# EAGLE design Steuerung (EAGLE 7.3.0)
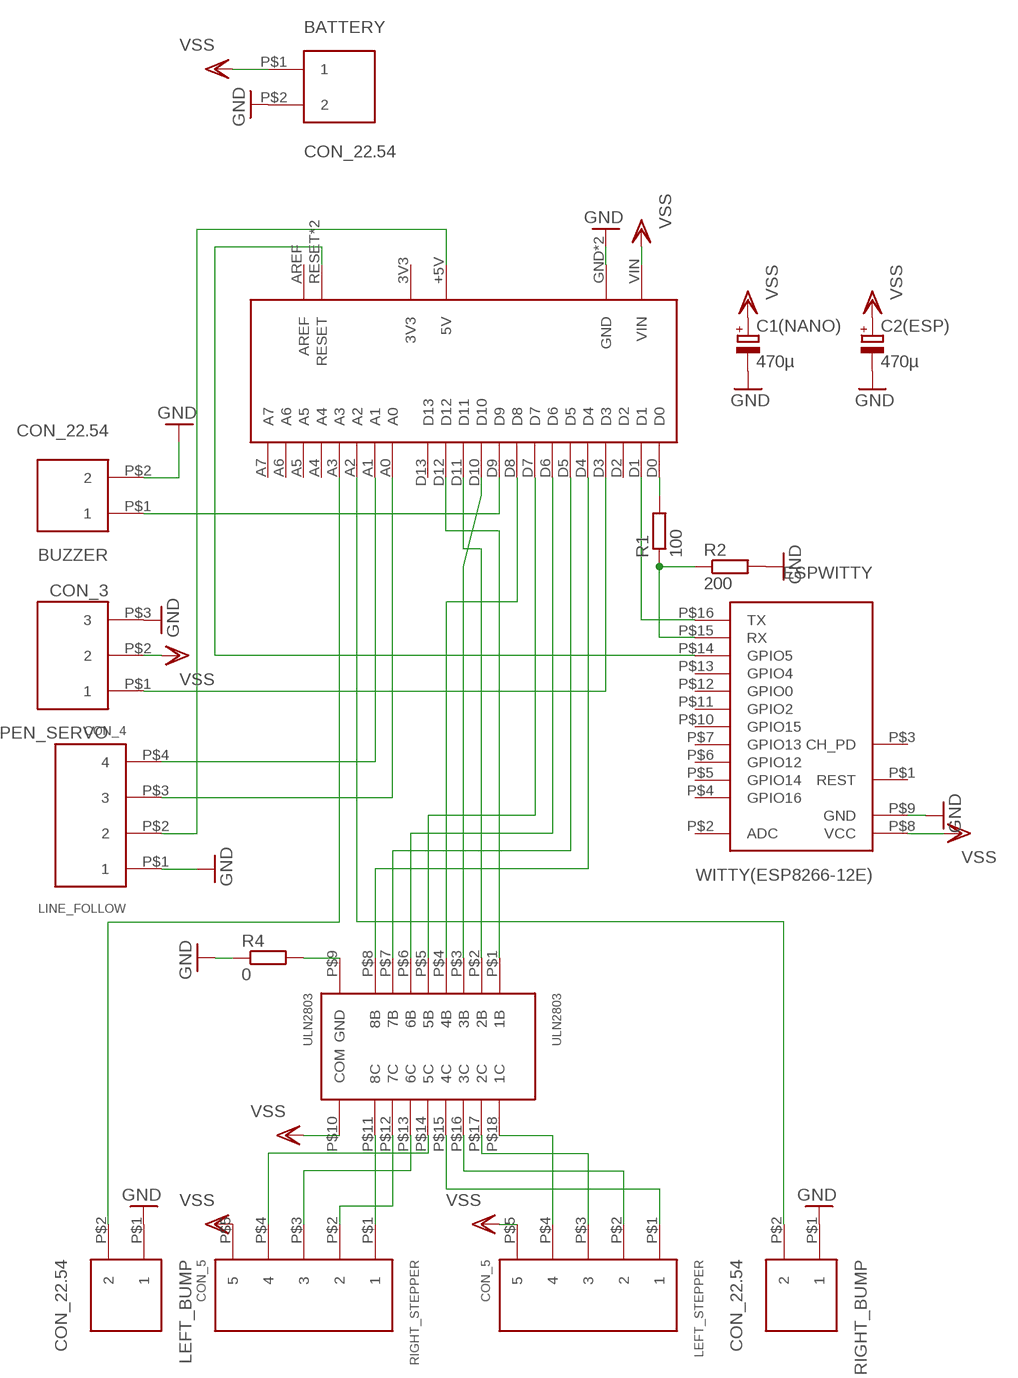
[diagram p0: schematic, sheet 1]

## Parts
ARDUINO_NANO  ARDUINO_NANO  [ARDUINO_NANO]
BATTERY  CON_22.54  [CON_2_2.54]
BUZZER  CON_22.54  [CON_2_2.54]
C1(NANO)  470µ  CPOL-EUE2.5-7  [E2,5-7]
C2(ESP)  470µ  CPOL-EUE2.5-7  [E2,5-7]
LEFT_BUMP  CON_22.54  [CON_2_2.54]
LEFT_STEPPER  CON_5  [CON_5_2.54]
LINE_FOLLOW  CON_4  [CON_4_2.54]
PEN_SERVO  CON_3  [CON_3_2.54]
R1  100  R-EU_0204/7  [0204/7]
R2  200  R-EU_0204/7  [0204/7]
R4  0  R-EU_R1206  [R1206]
RIGHT_BUMP  CON_22.54  [CON_2_2.54]
RIGHT_STEPPER  CON_5  [CON_5_2.54]
ULN2803  ULN2803  [DIP_18]
WITTY(ESP8266-12E)  ESPWITTY  [ESP-WITTY]

## Nets
GND: ARDUINO_NANO.GND ARDUINO_NANO.GND2(GND) BATTERY.P$2 BUZZER.P$2 C1(NANO).- C2(ESP).- LEFT_BUMP.P$1 LINE_FOLLOW.P$1 PEN_SERVO.P$3 R2.2 R4.1 RIGHT_BUMP.P$1 WITTY(ESP8266-12E).P$9(GND)
N$1: LEFT_STEPPER.P$4 ULN2803.P$18(1C)
N$2: LEFT_STEPPER.P$3 ULN2803.P$17(2C)
N$3: LEFT_STEPPER.P$2 ULN2803.P$16(3C)
N$4: LEFT_STEPPER.P$1 ULN2803.P$15(4C)
N$5: RIGHT_STEPPER.P$4 ULN2803.P$14(5C)
N$6: RIGHT_STEPPER.P$3 ULN2803.P$13(6C)
N$7: RIGHT_STEPPER.P$2 ULN2803.P$12(7C)
N$8: RIGHT_STEPPER.P$1 ULN2803.P$11(8C)
N$9: ARDUINO_NANO.D8 ULN2803.P$4(4B)
N$10: ARDUINO_NANO.D10 ULN2803.P$3(3B)
N$11: ARDUINO_NANO.D11 ULN2803.P$2(2B)
N$12: ARDUINO_NANO.D12 ULN2803.P$1(1B)
N$13: ARDUINO_NANO.D7 ULN2803.P$5(5B)
N$14: ARDUINO_NANO.D6 ULN2803.P$6(6B)
N$15: ARDUINO_NANO.D5 ULN2803.P$7(7B)
N$16: ARDUINO_NANO.D4 ULN2803.P$8(8B)
N$18: ARDUINO_NANO.A2 RIGHT_BUMP.P$2
N$19: ARDUINO_NANO.D0 R1.2
N$20: R1.1 R2.1 WITTY(ESP8266-12E).P$15(RX)
N$21: ARDUINO_NANO.D1 WITTY(ESP8266-12E).P$16(TX)
N$22: ARDUINO_NANO.RESET ARDUINO_NANO.RST(RESET) WITTY(ESP8266-12E).P$14(GPIO5)
N$23: ARDUINO_NANO.D9 BUZZER.P$1
N$24: ARDUINO_NANO.D3 PEN_SERVO.P$1
N$25: ARDUINO_NANO.A1 LINE_FOLLOW.P$4
N$26: ARDUINO_NANO.A0 LINE_FOLLOW.P$3
N$28: ARDUINO_NANO.A3 LEFT_BUMP.P$2
N$29: R4.2 ULN2803.P$9(GND)
N$30: ARDUINO_NANO.+5V(5V) LINE_FOLLOW.P$2
VSS: ARDUINO_NANO.VIN BATTERY.P$1 C1(NANO).+ C2(ESP).+ LEFT_STEPPER.P$5 PEN_SERVO.P$2 RIGHT_STEPPER.P$5 ULN2803.P$10(COM) WITTY(ESP8266-12E).P$8(VCC)
Unconnected: ARDUINO_NANO.3V3 ARDUINO_NANO.A4 ARDUINO_NANO.A5 ARDUINO_NANO.A6 ARDUINO_NANO.A7 ARDUINO_NANO.AREF ARDUINO_NANO.D2 ARDUINO_NANO.D13 WITTY(ESP8266-12E).P$1(REST) WITTY(ESP8266-12E).P$2(ADC) WITTY(ESP8266-12E).P$3(CH_PD) WITTY(ESP8266-12E).P$4(GPIO16) WITTY(ESP8266-12E).P$5(GPIO14) WITTY(ESP8266-12E).P$6(GPIO12) WITTY(ESP8266-12E).P$7(GPIO13) WITTY(ESP8266-12E).P$10(GPIO15) WITTY(ESP8266-12E).P$11(GPIO2) WITTY(ESP8266-12E).P$12(GPIO0) WITTY(ESP8266-12E).P$13(GPIO4)

## Library data of the parts
ARDUINO_NANO = pcaroli:ARDUINO_NANO
BATTERY BUZZER LEFT_BUMP RIGHT_BUMP = pcaroli:CON_2
C1(NANO) C2(ESP) = resistor:CPOL-EU: POLARIZED CAPACITOR, European symbol
LEFT_STEPPER RIGHT_STEPPER = pcaroli:CON_5
LINE_FOLLOW = pcaroli:CON_4
PEN_SERVO = pcaroli:CON_3
R1 R2 = resistor:R-EU_: RESISTOR, European symbol
R4 = rcl-2:R-EU_: RESISTOR, European symbol
ULN2803 = pcaroli:ULN2803
WITTY(ESP8266-12E) = pcaroli:ESP

## Board
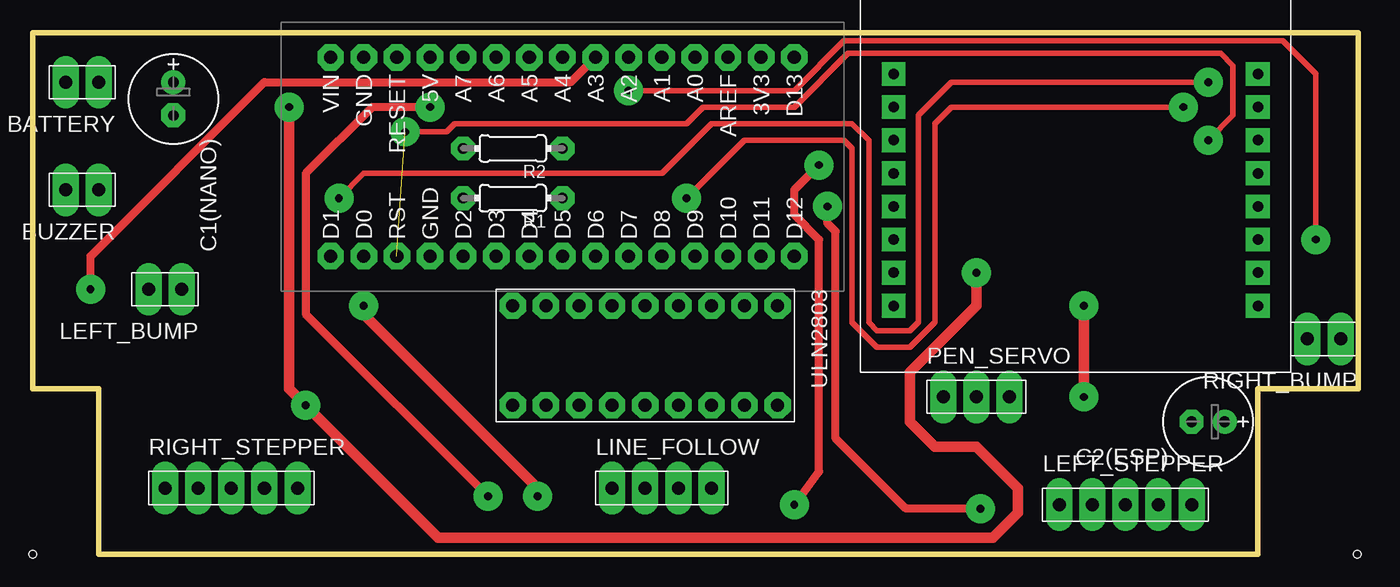
[diagram p1: board, top side]
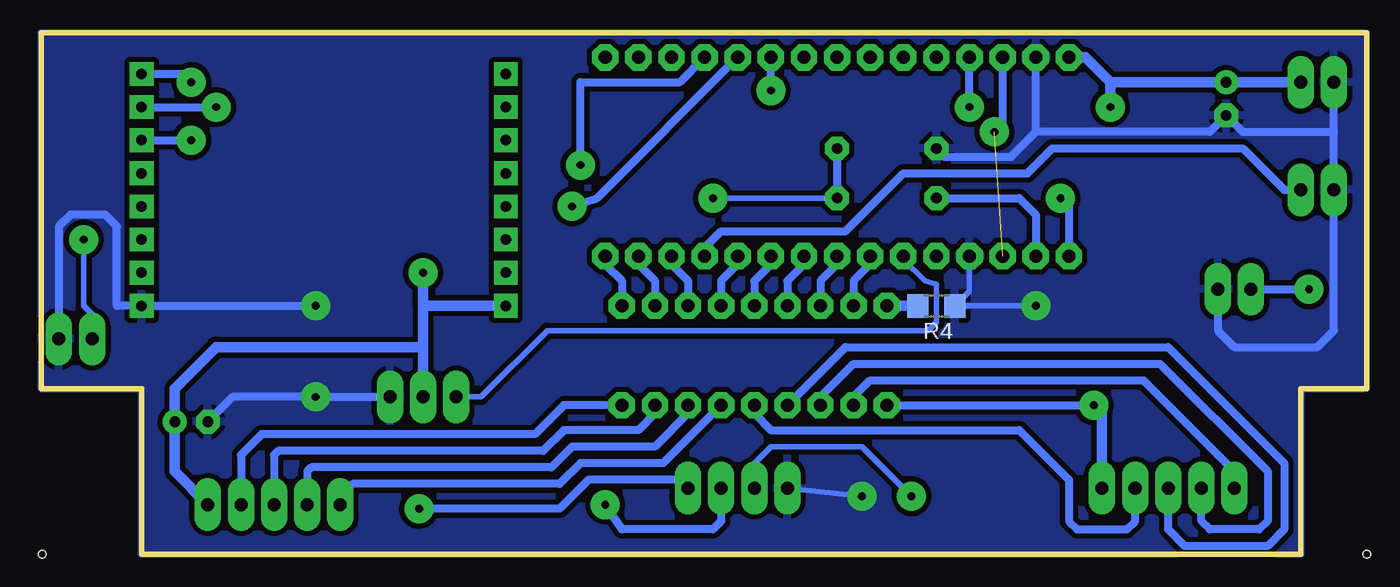
[diagram p2: board, bottom side, seen from below]

Size 101.68 x 40 mm. Coordinates in mm from the lower left corner, seen from the top.
Outline: 101.68,40 0,40 0,12.7 5.08,12.7 5.08,0 93.98,0 93.98,12.7 101.68,12.7 101.68,40
Copper layers (1*16): Top 0.035mm / dielectric 1.5mm / Bottom 0.035mm
Design rules "proxxon *": minimum track width 16mil, minimum drill 16mil, track to track 16mil, track to pad 16mil, pad to pad 16mil, via to via 16mil, smd to smd 8mil, copper to edge 0mil, drill to drill 40mil, minimum pad ring 20mil, minimum via ring 32mil, stop-mask expansion 4mil, vias tented up to drill 0mil, thermal gap 16mil
Holes 0.6 mm at 0,0 101.6,0

### Footprints (pad centres in the part's own frame; a part is rotated, then mirrored left to right if it is on the bottom)
ARDUINO_NANO = drill 1 octagon: 3V3 7.62,-15.24; +5V 7.62,10.16; A0 7.62,-10.16; A1 7.62,-7.62; A2 7.62,-5.08; A3 7.62,-2.54; A4 7.62,0; A5 7.62,2.54; A6 7.62,5.08; A7 7.62,7.62; AREF 7.62,-12.7; D0 -7.62,15.24; D1 -7.62,17.78; D2 -7.62,7.62; D3 -7.62,5.08; D4 -7.62,2.54; D5 -7.62,0; D6 -7.62,-2.54; D7 -7.62,-5.08; D8 -7.62,-7.62; D9 -7.62,-10.16; D10 -7.62,-12.7; D11 -7.62,-15.24; D12 -7.62,-17.78; D13 7.62,-17.78; GND -7.62,10.16; GND2 7.62,15.24; RESET 7.62,12.7; RST -7.62,12.7; VIN 7.62,17.78
CON_2_2.54 = drill 1 pad 1.93 long: P$1 -1.27,0; P$2 1.27,0
E2,5-7 = drill 0.813 pad 1.6: + -1.27,0 | drill 0.813 pad 1.6 octagon: - 1.27,0
CON_5_2.54 = drill 1 pad 1.93 long: P$1 -5.08,0; P$2 -2.54,0; P$3 0,0; P$4 2.54,0; P$5 5.08,0
CON_4_2.54 = drill 1 pad 1.93 long: P$1 -3.81,0; P$2 -1.27,0; P$3 1.27,0; P$4 3.81,0
CON_3_2.54 = drill 1 pad 1.93 long: P$1 -2.54,0; P$2 0,0; P$3 2.54,0
0204/7 = drill 0.813 octagon: 1 -3.81,0; 2 3.81,0
R1206 = smd 1.6 x 1.803: 1 -1.422,0; 2 1.422,0
DIP_18 = drill 1 octagon: P$1 -3.81,10.16; P$2 -3.81,7.62; P$3 -3.81,5.08; P$4 -3.81,2.54; P$5 -3.81,0; P$6 -3.81,-2.54; P$7 -3.81,-5.08; P$8 -3.81,-7.62; P$9 -3.81,-10.16; P$10 3.81,-10.16; P$11 3.81,-7.62; P$12 3.81,-5.08; P$13 3.81,-2.54; P$14 3.81,0; P$15 3.81,2.54; P$16 3.81,5.08; P$17 3.81,7.62; P$18 3.81,10.16
ESP-WITTY = drill 0.8 square: P$1 0,0; P$2 0,-2.54; P$3 0,-5.08; P$4 0,-7.62; P$5 0,-10.16; P$6 0,-12.7; P$7 0,-15.24; P$8 0,-17.78; P$9 27.94,-17.78; P$10 27.94,-15.24; P$11 27.94,-12.7; P$12 27.94,-10.16; P$13 27.94,-7.62; P$14 27.94,-5.08; P$15 27.94,-2.54; P$16 27.94,0

### Placement (x,y rotation side)
ARDUINO_NANO  40.64,30.48 90 top
BATTERY  3.81,36.2 180 top
BUZZER  3.81,27.94 180 top
C1(NANO)  10.79,34.92 270 top
C2(ESP)  90.17,10.16 180 top
LEFT_BUMP  10.16,20.32 180 top
LEFT_STEPPER  83.82,3.81 0 top
LINE_FOLLOW  48.26,5.08 0 top
PEN_SERVO  72.39,12.06 0 top
R1  36.83,27.3 180 top
R2  36.83,31.11 180 top
R4  33.02,19.05 180 bottom
RIGHT_BUMP  99.06,16.51 180 top
RIGHT_STEPPER  15.24,5.08 0 top
ULN2803  46.99,15.24 270 top
WITTY(ESP8266-12E)  66.04,36.83 0 top

### Tracks (layer width: path | path; a pad name or v marks a point on that pad's centre or on a via)
GND  (via drill 0.6)
  Top 0.813: v80.64,19.05 v80.64,12.06 | v38.73,4.45 38.73,5.08 25.4,18.41 v25.4,19.05
  Bottom 0.406: ARDUINO_NANO.GND 30.48,20.17 R4.1 v25.4,19.05 | LINE_FOLLOW.P$1 v38.73,4.45
  Bottom 0.61: C2(ESP).- 87,12.06 v80.64,12.06 PEN_SERVO.P$3 | RIGHT_BUMP.P$1 100.33,25.14 99.43,26.04 96.78,26.04 95.89,25.14 95.89,19.05 WITTY(ESP8266-12E).P$9 v80.64,19.05 | LEFT_BUMP.P$1 11.43,17.14 10.16,15.88 3.81,15.88 2.54,17.14 BUZZER.P$2 2.54,32.38 | 2.54,32.38 BATTERY.P$2 | 2.54,32.38 9.53,32.38 C1(NANO).- 12.06,32.38 25.4,32.38 | 25.4,32.38 ARDUINO_NANO.GND2 | R2.2 32.38,30.48 27.3,30.48 25.4,32.38
  pour Bottom: 0.38,40.01 0.38,12.7 5.08,12.7 5.08,0 93.98,0 93.98,12.7 101.68,12.7 101.68,40.01
N$1
  Bottom 0.61: ULN2803.P$18 61.59,11.43 63.82,9.21 84.77,9.21 86.36,7.62 LEFT_STEPPER.P$4
N$2
  Bottom 0.61: ULN2803.P$17 54.61,10.79 55.88,9.53 61.59,9.53 63.18,7.94 83.5,7.94 83.82,7.62 LEFT_STEPPER.P$3
N$3
  Bottom 0.61: ULN2803.P$16 52.07,10.79 54.61,8.26 60.96,8.26 62.55,6.67 80.96,6.67 81.28,6.35 LEFT_STEPPER.P$2
N$4
  Bottom 0.61: ULN2803.P$15 53.98,6.99 60.33,6.99 61.91,5.4 77.79,5.4 78.74,4.45 LEFT_STEPPER.P$1
N$5
  Bottom 0.61: ULN2803.P$14 46.99,10.79 45.72,9.53 26.67,9.53 22.86,5.71 22.86,2.54 22.23,1.91 18.41,1.91 17.78,2.54 RIGHT_STEPPER.P$4
N$6
  Bottom 0.61: ULN2803.P$13 40.01,15.88 15.24,15.88 6.35,6.99 6.35,1.91 7.62,0.64 13.97,0.64 15.24,1.91 RIGHT_STEPPER.P$3
N$7
  Bottom 0.61: ULN2803.P$12 41.91,12.06 39.37,14.61 15.88,14.61 7.62,6.35 7.62,2.54 8.26,1.91 12.06,1.91 12.7,2.54 RIGHT_STEPPER.P$2
N$8
  Bottom 0.61: ULN2803.P$11 39.37,12.06 38.1,13.34 17.14,13.34 10.16,6.35 RIGHT_STEPPER.P$1
N$9
  Bottom 0.61: ARDUINO_NANO.D8 48.26,22.23 49.53,20.95 ULN2803.P$4
N$10
  Bottom 0.61: ARDUINO_NANO.D10 53.34,22.23 52.07,20.95 ULN2803.P$3
N$11
  Bottom 0.61: ARDUINO_NANO.D11 55.88,22.23 54.61,20.95 ULN2803.P$2
N$12
  Bottom 0.61: ARDUINO_NANO.D12 58.42,22.23 57.15,20.95 ULN2803.P$1
N$13
  Bottom 0.61: ARDUINO_NANO.D7 45.72,22.23 46.99,20.95 ULN2803.P$5
N$14
  Bottom 0.61: ARDUINO_NANO.D6 43.18,22.23 44.45,20.95 ULN2803.P$6
N$15
  Bottom 0.61: ARDUINO_NANO.D5 40.64,22.23 41.91,20.95 ULN2803.P$7
N$16
  Bottom 0.61: ARDUINO_NANO.D4 38.1,22.23 39.37,20.95 ULN2803.P$8
N$18  (via drill 0.6)
  Top 0.406: v45.72,35.56 58.42,35.56 62.23,39.37 95.89,39.37 98.42,36.83 v98.42,24.13
  Bottom 0.406: v98.42,24.13 98.42,19.05 97.79,18.41 RIGHT_BUMP.P$2
  Bottom 0.61: v45.72,35.56 ARDUINO_NANO.A2
N$19
  Bottom 0.61: R1.2 26.67,27.3 25.4,26.04 ARDUINO_NANO.D0
N$20  (via drill 0.6)
  Top 0.406: v88.27,34.29 70.48,34.29 69.22,33.02 69.22,17.78 67.31,15.88 64.77,15.88 62.87,17.78 62.87,31.11 62.23,31.75 54.61,31.75 v50.16,27.3
  Bottom 0.406: v50.16,27.3 R1.1
  Bottom 0.61: R2.1 R1.1 | WITTY(ESP8266-12E).P$15 v88.27,34.29
N$21  (via drill 0.6)
  Top 0.406: v90.17,36.2 70.48,36.2 67.94,33.66 67.94,17.78 67.31,17.14 64.77,17.14 64.14,17.78 64.14,31.75 62.87,33.02 52.07,33.02 48.26,29.21 25.4,29.21 v23.5,27.3
  Bottom 0.61: WITTY(ESP8266-12E).P$16 90.81,36.83 v90.17,36.2 | v23.5,27.3 22.86,26.67 ARDUINO_NANO.D1
N$22  (via drill 0.6)  (1 unrouted)
  Top 0.406: v28.57,32.38 31.75,32.38 32.38,33.02 50.16,33.02 51.44,34.29 58.42,34.29 62.55,38.42 91.12,38.42 92.08,37.47 92.08,33.66 v90.17,31.75
  Bottom 0.61: WITTY(ESP8266-12E).P$14 v90.17,31.75 | v28.57,32.38 27.94,33.02 ARDUINO_NANO.RESET
N$23
  Bottom 0.61: ARDUINO_NANO.D9 50.8,23.5 49.53,24.77 40.01,24.77 35.56,29.21 26.04,29.21 24.13,31.11 9.53,31.11 6.35,27.94 BUZZER.P$1
N$24
  Bottom 0.406: PEN_SERVO.P$1 67.94,12.06 62.87,17.14 33.66,17.14 33.02,17.78 33.02,20.69 33.92,20.95 35.56,22.6 ARDUINO_NANO.D3
N$25  (via drill 0.6)
  Top 0.61: v72.71,3.49 66.99,3.49 61.59,8.89 61.59,24.77 60.96,25.4 v60.96,26.67
  Bottom 0.61: LINE_FOLLOW.P$4 52.07,5.71 59.69,5.71 61.91,3.49 v72.71,3.49 | v60.96,26.67 59.05,27.3 ARDUINO_NANO.A1
N$26  (via drill 0.6)
  Top 0.61: v58.42,3.81 60.33,6.35 60.33,24.13 58.42,26.04 58.42,27.94 v60.33,29.84
  Bottom 0.61: LINE_FOLLOW.P$3 49.53,2.54 50.16,1.91 57.15,1.91 v58.42,3.81 | v60.33,29.84 60.33,36.2 52.7,36.2 ARDUINO_NANO.A0
N$28  (via drill 0.6)
  Top 0.61: v4.45,20.32 4.45,22.86 17.78,36.2 41.27,36.2 ARDUINO_NANO.A3
  Bottom 0.61: LEFT_BUMP.P$2 v4.45,20.32
N$29
  Bottom 0.813: ULN2803.P$9 R4.2
N$30  (via drill 0.6)
  Top 0.61: v30.48,34.29 26.04,34.29 20.95,29.21 20.95,18.41 v34.92,4.45
  Bottom 0.406: v34.92,4.45 38.73,8.26 45.72,8.26 46.99,6.99 LINE_FOLLOW.P$2
  Bottom 0.61: v30.48,34.29 ARDUINO_NANO.+5V
VSS  (via drill 0.6)
  Top 0.813: v19.68,34.29 19.68,12.7 v20.95,11.43 31.11,1.27 73.66,1.27 75.56,3.17 75.56,5.08 72.39,8.26 69.22,8.26 67.31,10.16 67.31,13.97 72.39,19.05 v72.39,21.59
  Bottom 0.61: ULN2803.P$10 v20.95,11.43
  Bottom 0.813: BATTERY.P$1 C1(NANO).+ 19.68,36.2 | LEFT_STEPPER.P$5 91.44,6.35 C2(ESP).+ 91.44,12.7 88.27,15.88 72.39,15.88 | 72.39,15.88 PEN_SERVO.P$2 | 72.39,19.05 72.39,15.88 | WITTY(ESP8266-12E).P$8 72.39,19.05 | 72.39,19.05 v72.39,21.59 | 19.68,36.2 v19.68,34.29 | ARDUINO_NANO.VIN 21.59,38.1 19.68,36.2 | RIGHT_STEPPER.P$5 20.32,10.79 v20.95,11.43